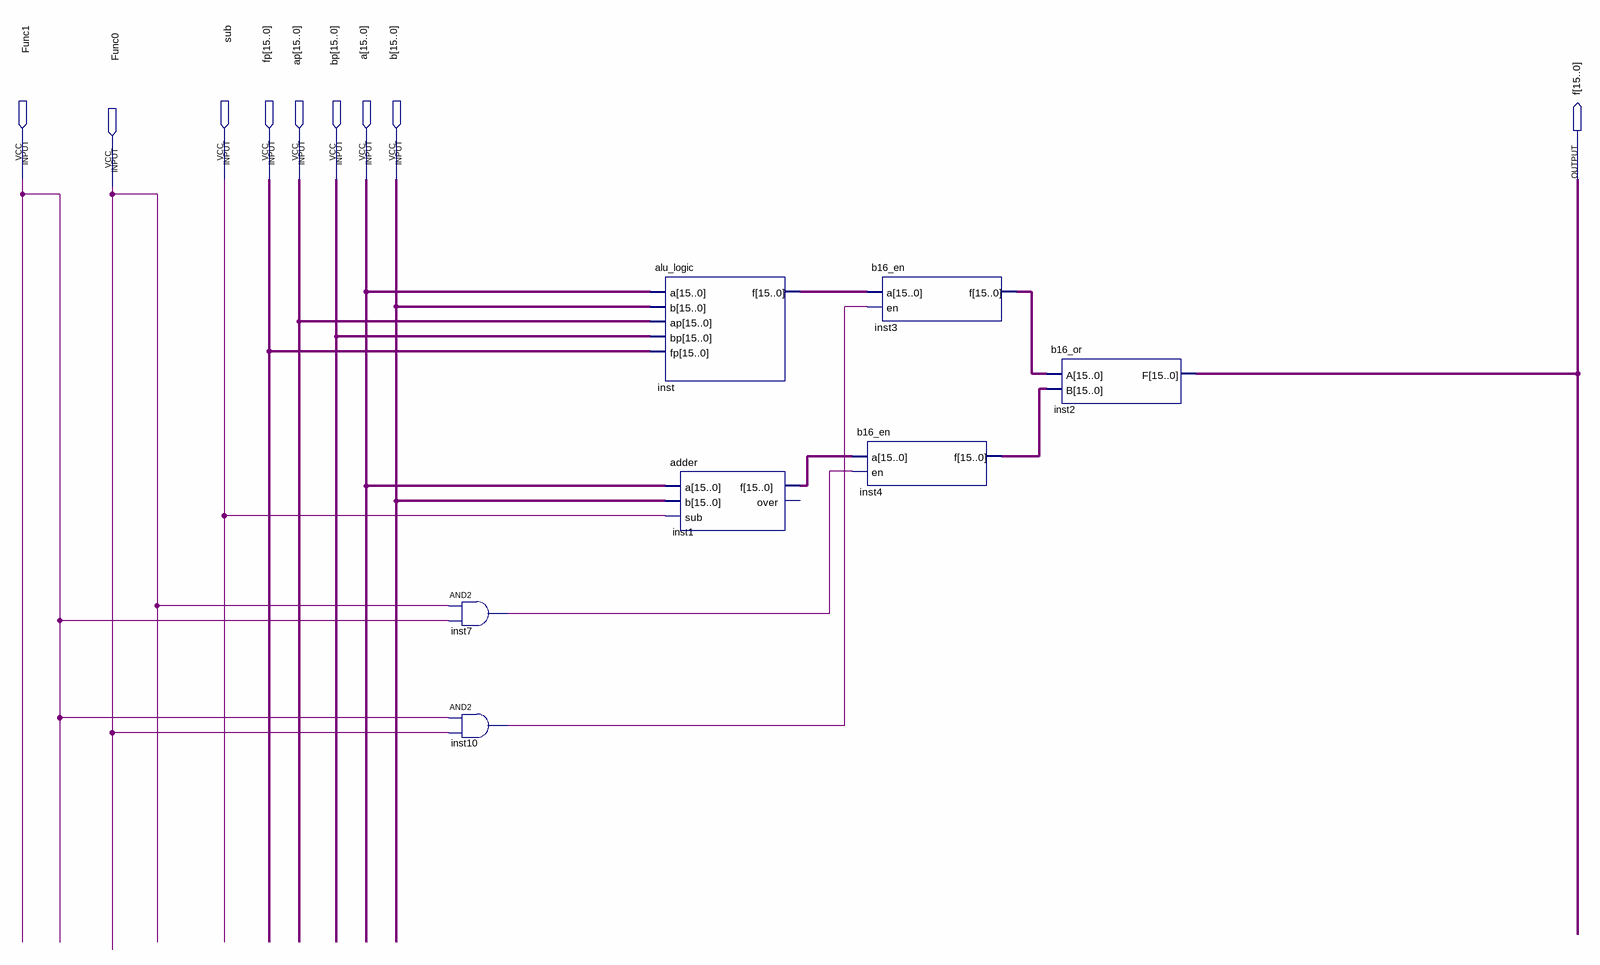
[diagram p0: schematic sheet]
// Quartus schematic alu.bdf as structural Verilog: 7 symbols, 9 pins
module alu (
  input  Func1,
  input  sub,
  input  [15:0] fp,
  input  [15:0] ap,
  input  [15:0] bp,
  input  [15:0] a,
  input  [15:0] b,
  input  Func0,
  output [15:0] f
);

  wire inst7_out, inst10_out;
  wire [15:0] inst1_f, inst3_f, inst4_f, inst_f;

  and inst7 (inst7_out, Func0, Func1);
  and inst10 (inst10_out, Func1, Func0);
  alu_logic inst (.a(a), .b(b), .ap(ap), .bp(bp), .fp(fp), .f(inst_f));
  adder inst1 (.a(a), .b(b), .sub(sub), .f(inst1_f));  // open: over
  b16_en inst4 (.a(inst1_f), .en(inst7_out), .f(inst4_f));
  b16_en inst3 (.a(inst_f), .en(inst10_out), .f(inst3_f));
  b16_or inst2 (.A(inst3_f), .B(inst4_f), .F(f));
endmodule
